# EAGLE design piezo-driver_v0.1-R001 (EAGLE 6.5.0)
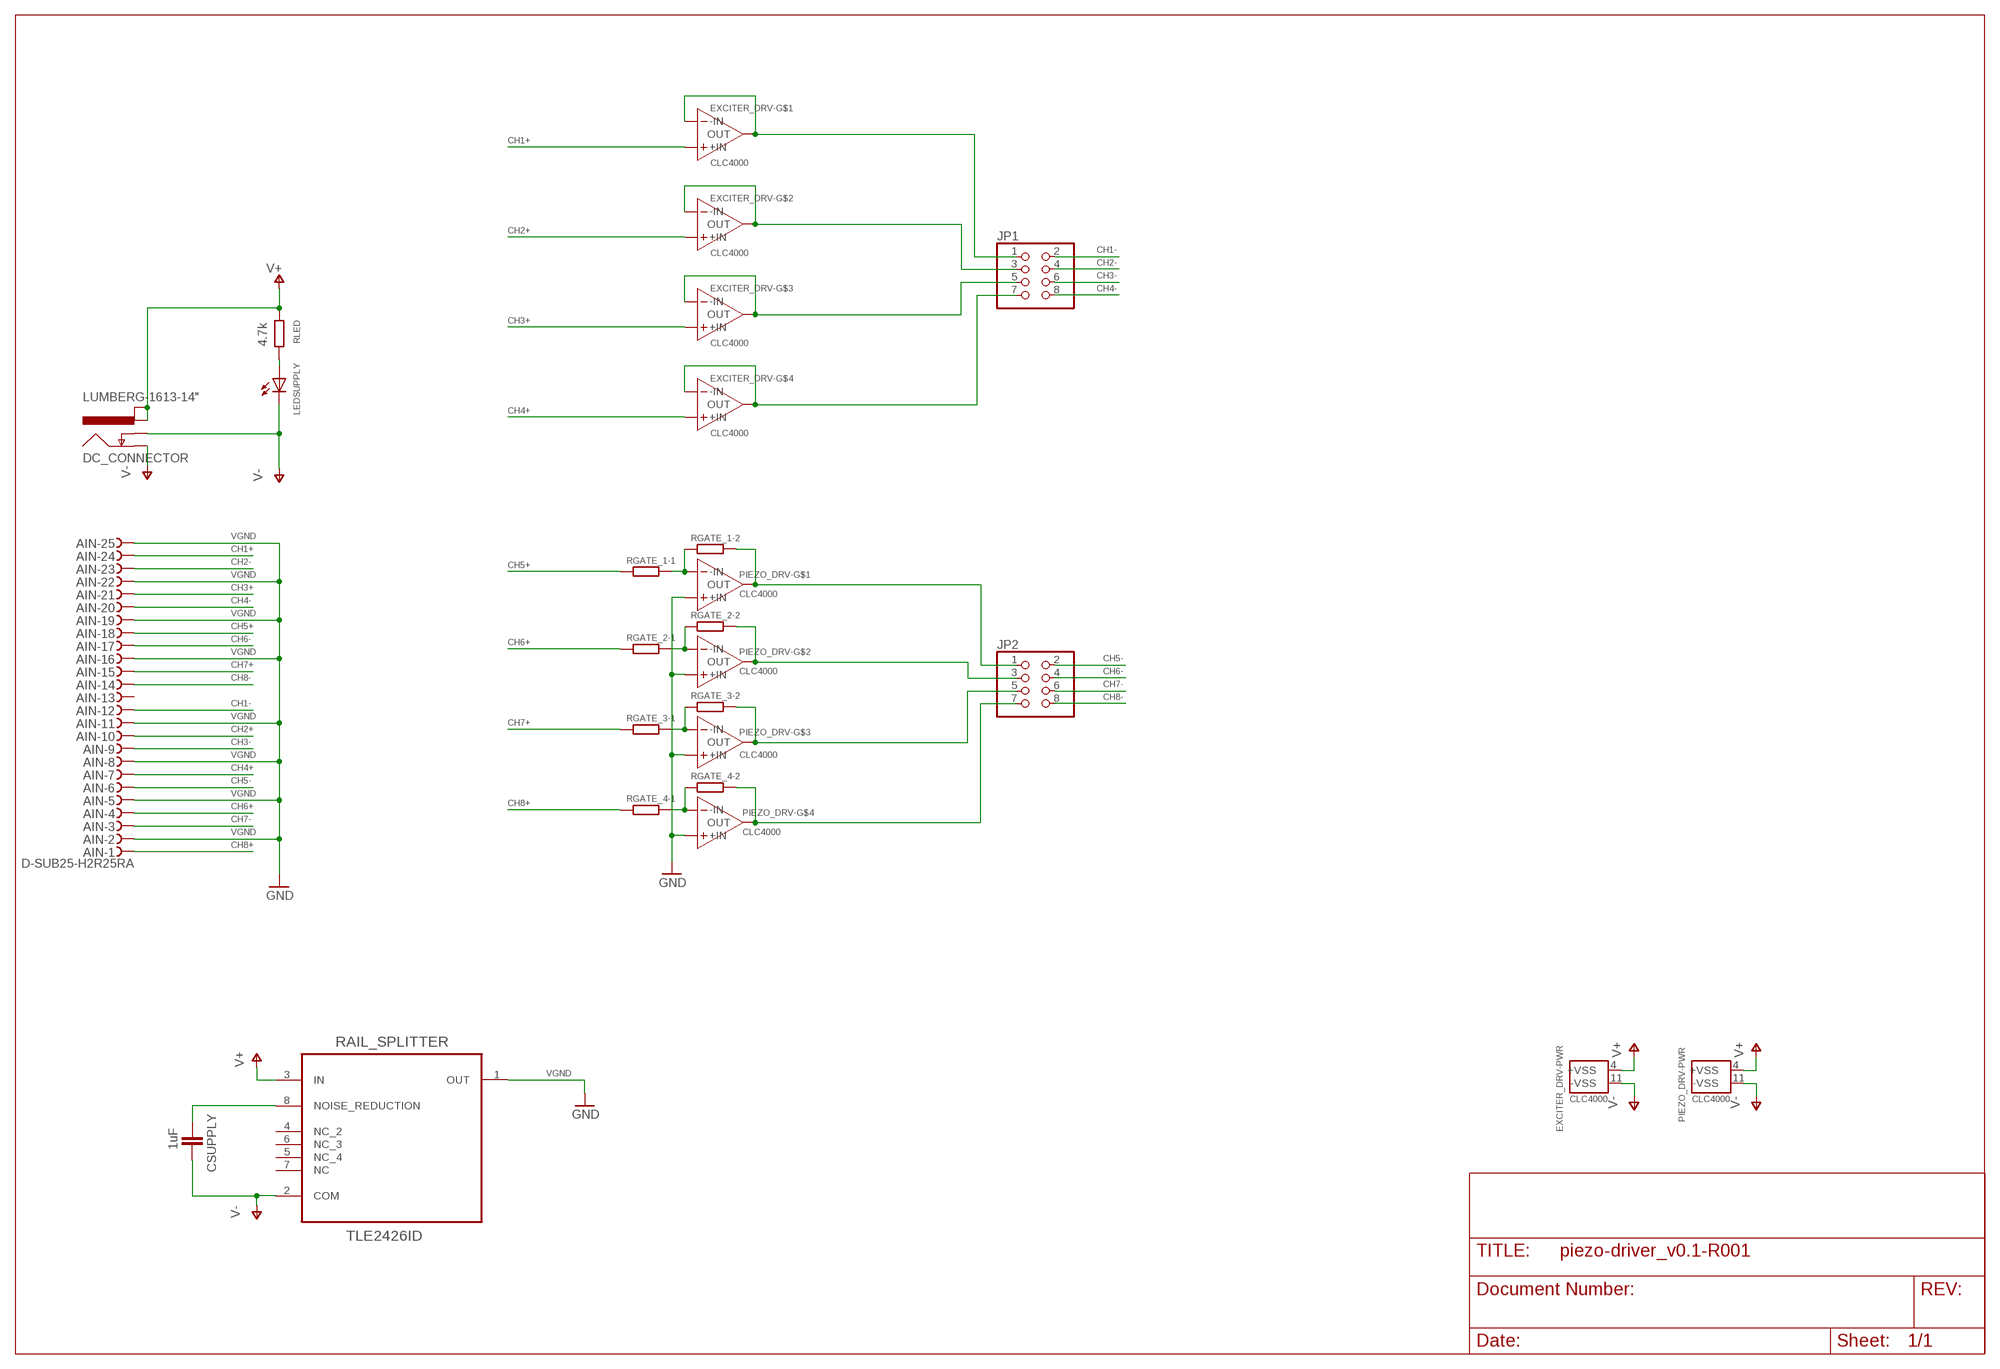
[diagram p0: schematic, sheet 1]

## Parts
AIN  D-SUB25-H2R25RA  [H2R25RA]
CSUPPLY  1uF  C-EUC0603  [C0603]
DC_CONNECTOR  LUMBERG-1613-14"  [LUMBERG-1613_14]
EXCITER_DRV  CLC4000  [SOIC-14]
JP1  PINHD-2X4/90  [2X04/90]
JP2  PINHD-2X4/90  [2X04/90]
LEDSUPPLY  LED3MM  [LED3MM]
PIEZO_DRV  CLC4000  [SOIC-14]
RAIL_SPLITTER  TLE2426ID  [SOIC127P600X175-8N]
RGATE_1-1  R-EU_R0805  [R0805]
RGATE_1-2  R-EU_R0805  [R0805]
RGATE_2-1  R-EU_R0805  [R0805]
RGATE_2-2  R-EU_R0805  [R0805]
RGATE_3-1  R-EU_R0805  [R0805]
RGATE_3-2  R-EU_R0805  [R0805]
RGATE_4-1  R-EU_R0805  [R0805]
RGATE_4-2  R-EU_R0805  [R0805]
RLED  4.7k  R-EU_R0805  [R0805]

## Nets
CH1+: AIN.24 EXCITER_DRV.3(-G$1:+IN)
CH1-: AIN.12 JP1.2
CH2+: AIN.10 EXCITER_DRV.5(-G$2:+IN)
CH2-: AIN.23 JP1.4
CH3+: AIN.21 EXCITER_DRV.10(-G$3:+IN)
CH3-: AIN.9 JP1.6
CH4+: AIN.7 EXCITER_DRV.12(-G$4:+IN)
CH4-: AIN.20 JP1.8
CH5+: AIN.18 RGATE_1-1.1
CH5-: AIN.6 JP2.2
CH6+: AIN.4 RGATE_2-1.1
CH6-: AIN.17 JP2.4
CH7+: AIN.15 RGATE_3-1.1
CH7-: AIN.3 JP2.6
CH8+: AIN.1 RGATE_4-1.1
CH8-: AIN.14 JP2.8
N$1: EXCITER_DRV.1(-G$1:OUT) EXCITER_DRV.2(-G$1:-IN) JP1.1
N$2: EXCITER_DRV.6(-G$2:-IN) EXCITER_DRV.7(-G$2:OUT) JP1.3
N$3: EXCITER_DRV.8(-G$3:OUT) EXCITER_DRV.9(-G$3:-IN) JP1.5
N$4: EXCITER_DRV.13(-G$4:-IN) EXCITER_DRV.14(-G$4:OUT) JP1.7
N$5: CSUPPLY.1 RAIL_SPLITTER.8(NOISE_REDUCTION)
N$6: PIEZO_DRV.2(-G$1:-IN) RGATE_1-1.2 RGATE_1-2.1
N$7: JP2.1 PIEZO_DRV.1(-G$1:OUT) RGATE_1-2.2
N$8: PIEZO_DRV.6(-G$2:-IN) RGATE_2-1.2 RGATE_2-2.1
N$9: JP2.3 PIEZO_DRV.7(-G$2:OUT) RGATE_2-2.2
N$10: PIEZO_DRV.9(-G$3:-IN) RGATE_3-1.2 RGATE_3-2.1
N$11: JP2.5 PIEZO_DRV.8(-G$3:OUT) RGATE_3-2.2
N$12: PIEZO_DRV.13(-G$4:-IN) RGATE_4-1.2 RGATE_4-2.1
N$13: JP2.7 PIEZO_DRV.14(-G$4:OUT) RGATE_4-2.2
N$15: LEDSUPPLY.A RLED.1
V+: DC_CONNECTOR.3(PWR_1) DC_CONNECTOR.4(PWR_2) EXCITER_DRV.4(-PWR:+VSS) PIEZO_DRV.4(-PWR:+VSS) RAIL_SPLITTER.3(IN) RLED.2
V-: CSUPPLY.2 DC_CONNECTOR.1(GND) DC_CONNECTOR.2(GND_INS) EXCITER_DRV.11(-PWR:-VSS) LEDSUPPLY.K(C) PIEZO_DRV.11(-PWR:-VSS) RAIL_SPLITTER.2(COM)
VGND: AIN.2 AIN.5 AIN.8 AIN.11 AIN.16 AIN.19 AIN.22 AIN.25 PIEZO_DRV.3(-G$1:+IN) PIEZO_DRV.5(-G$2:+IN) PIEZO_DRV.10(-G$3:+IN) PIEZO_DRV.12(-G$4:+IN) RAIL_SPLITTER.1(OUT) ; supply symbol labelled GND
Unconnected: AIN.13 RAIL_SPLITTER.4(NC_2) RAIL_SPLITTER.5(NC_4) RAIL_SPLITTER.6(NC_3) RAIL_SPLITTER.7(NC)

## Library data of the parts
AIN = ICST:D-SUB25-: D-Subminiatur Connector Source: Electronioc Interconnects European Edition 1998; OC_FARNELL: unknown; OC_NEWARK: unknown
CSUPPLY = rcl:C-EU: CAPACITOR, European symbol
DC_CONNECTOR = SABRe:LUMBERG-1613-14
EXCITER_DRV PIEZO_DRV = ICST:CLC4000
JP1 JP2 = ICST:PINHD-2X4: PIN HEADER
LEDSUPPLY = SABRe:LED: LEDs Standard schematic elements and footprints for packages: 5mm 3mm 1206 0603
RAIL_SPLITTER = Texas Instruments_By_element14_Batch_1:TLE2426ID: PRECISION VIRTUAL GROUND; MPN: TLE2426ID; OC_FARNELL: 8454833; OC_NEWARK: 35K1234; PACKAGE: SOIC-8; SUPPLIER: Texas Instruments
RGATE_1-1 RGATE_1-2 RGATE_2-1 RGATE_2-2 RGATE_3-1 RGATE_3-2 RGATE_4-1 RGATE_4-2 RLED = rcl:R-EU_: RESISTOR, European symbol

## Board
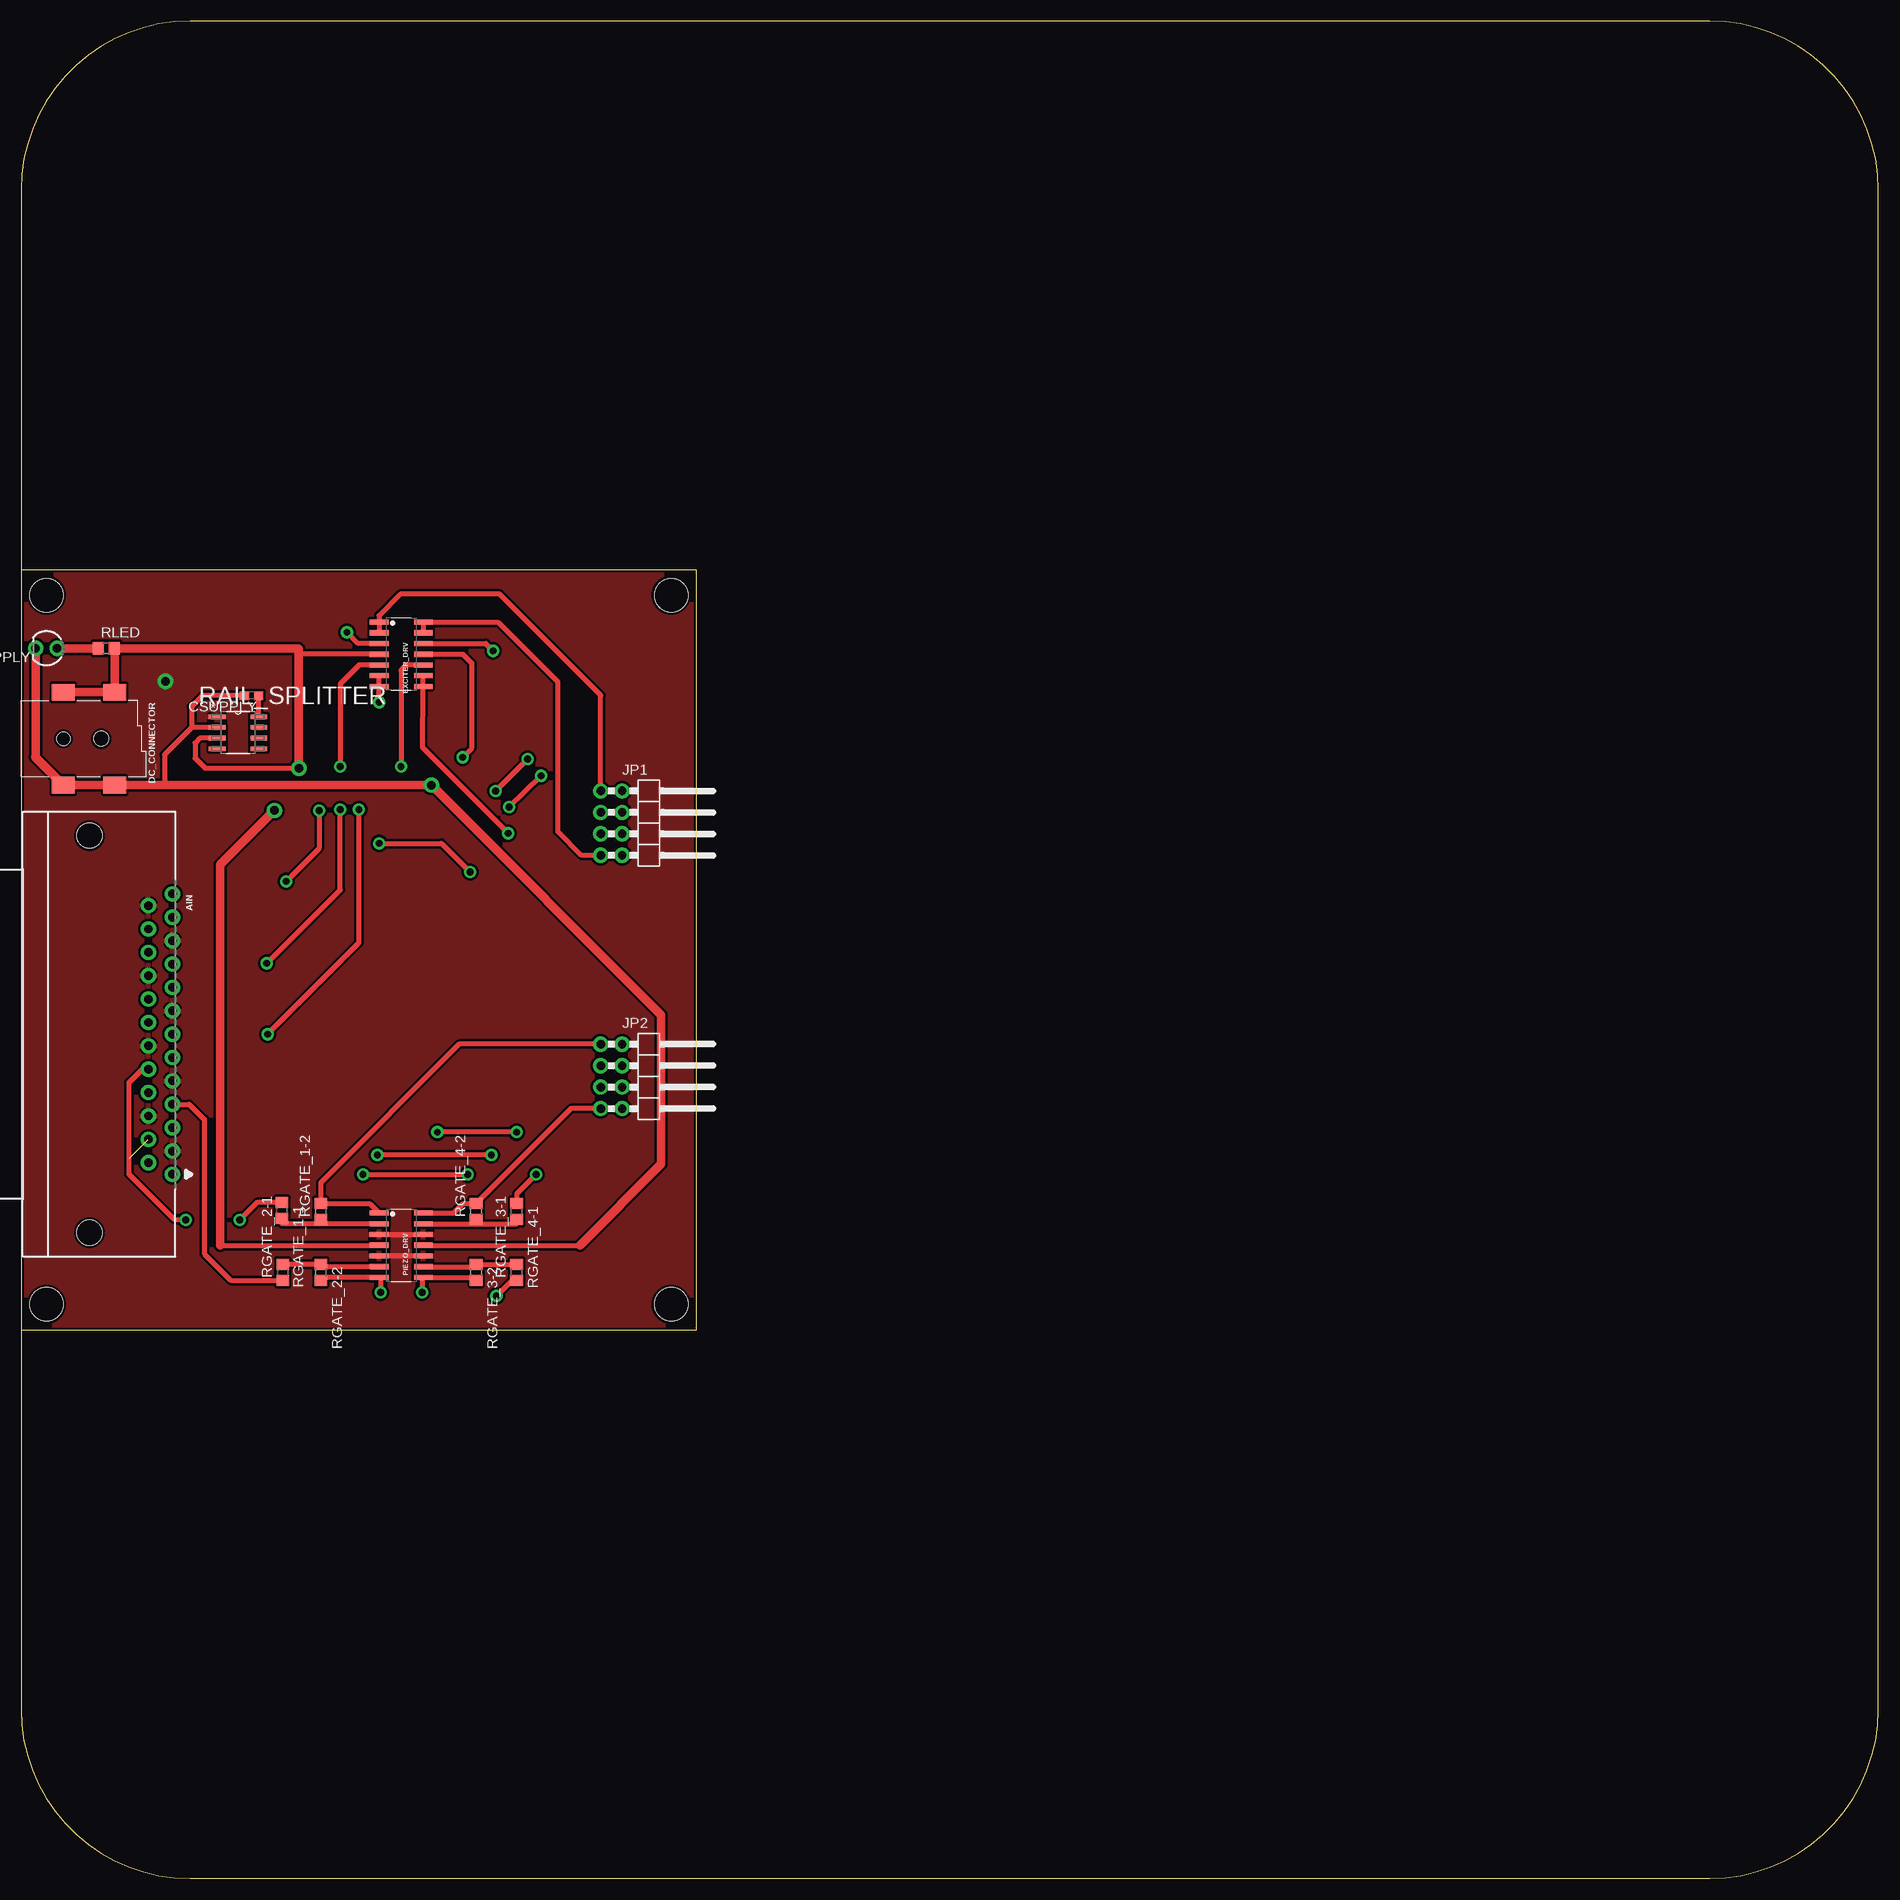
[diagram p1: board, top side]
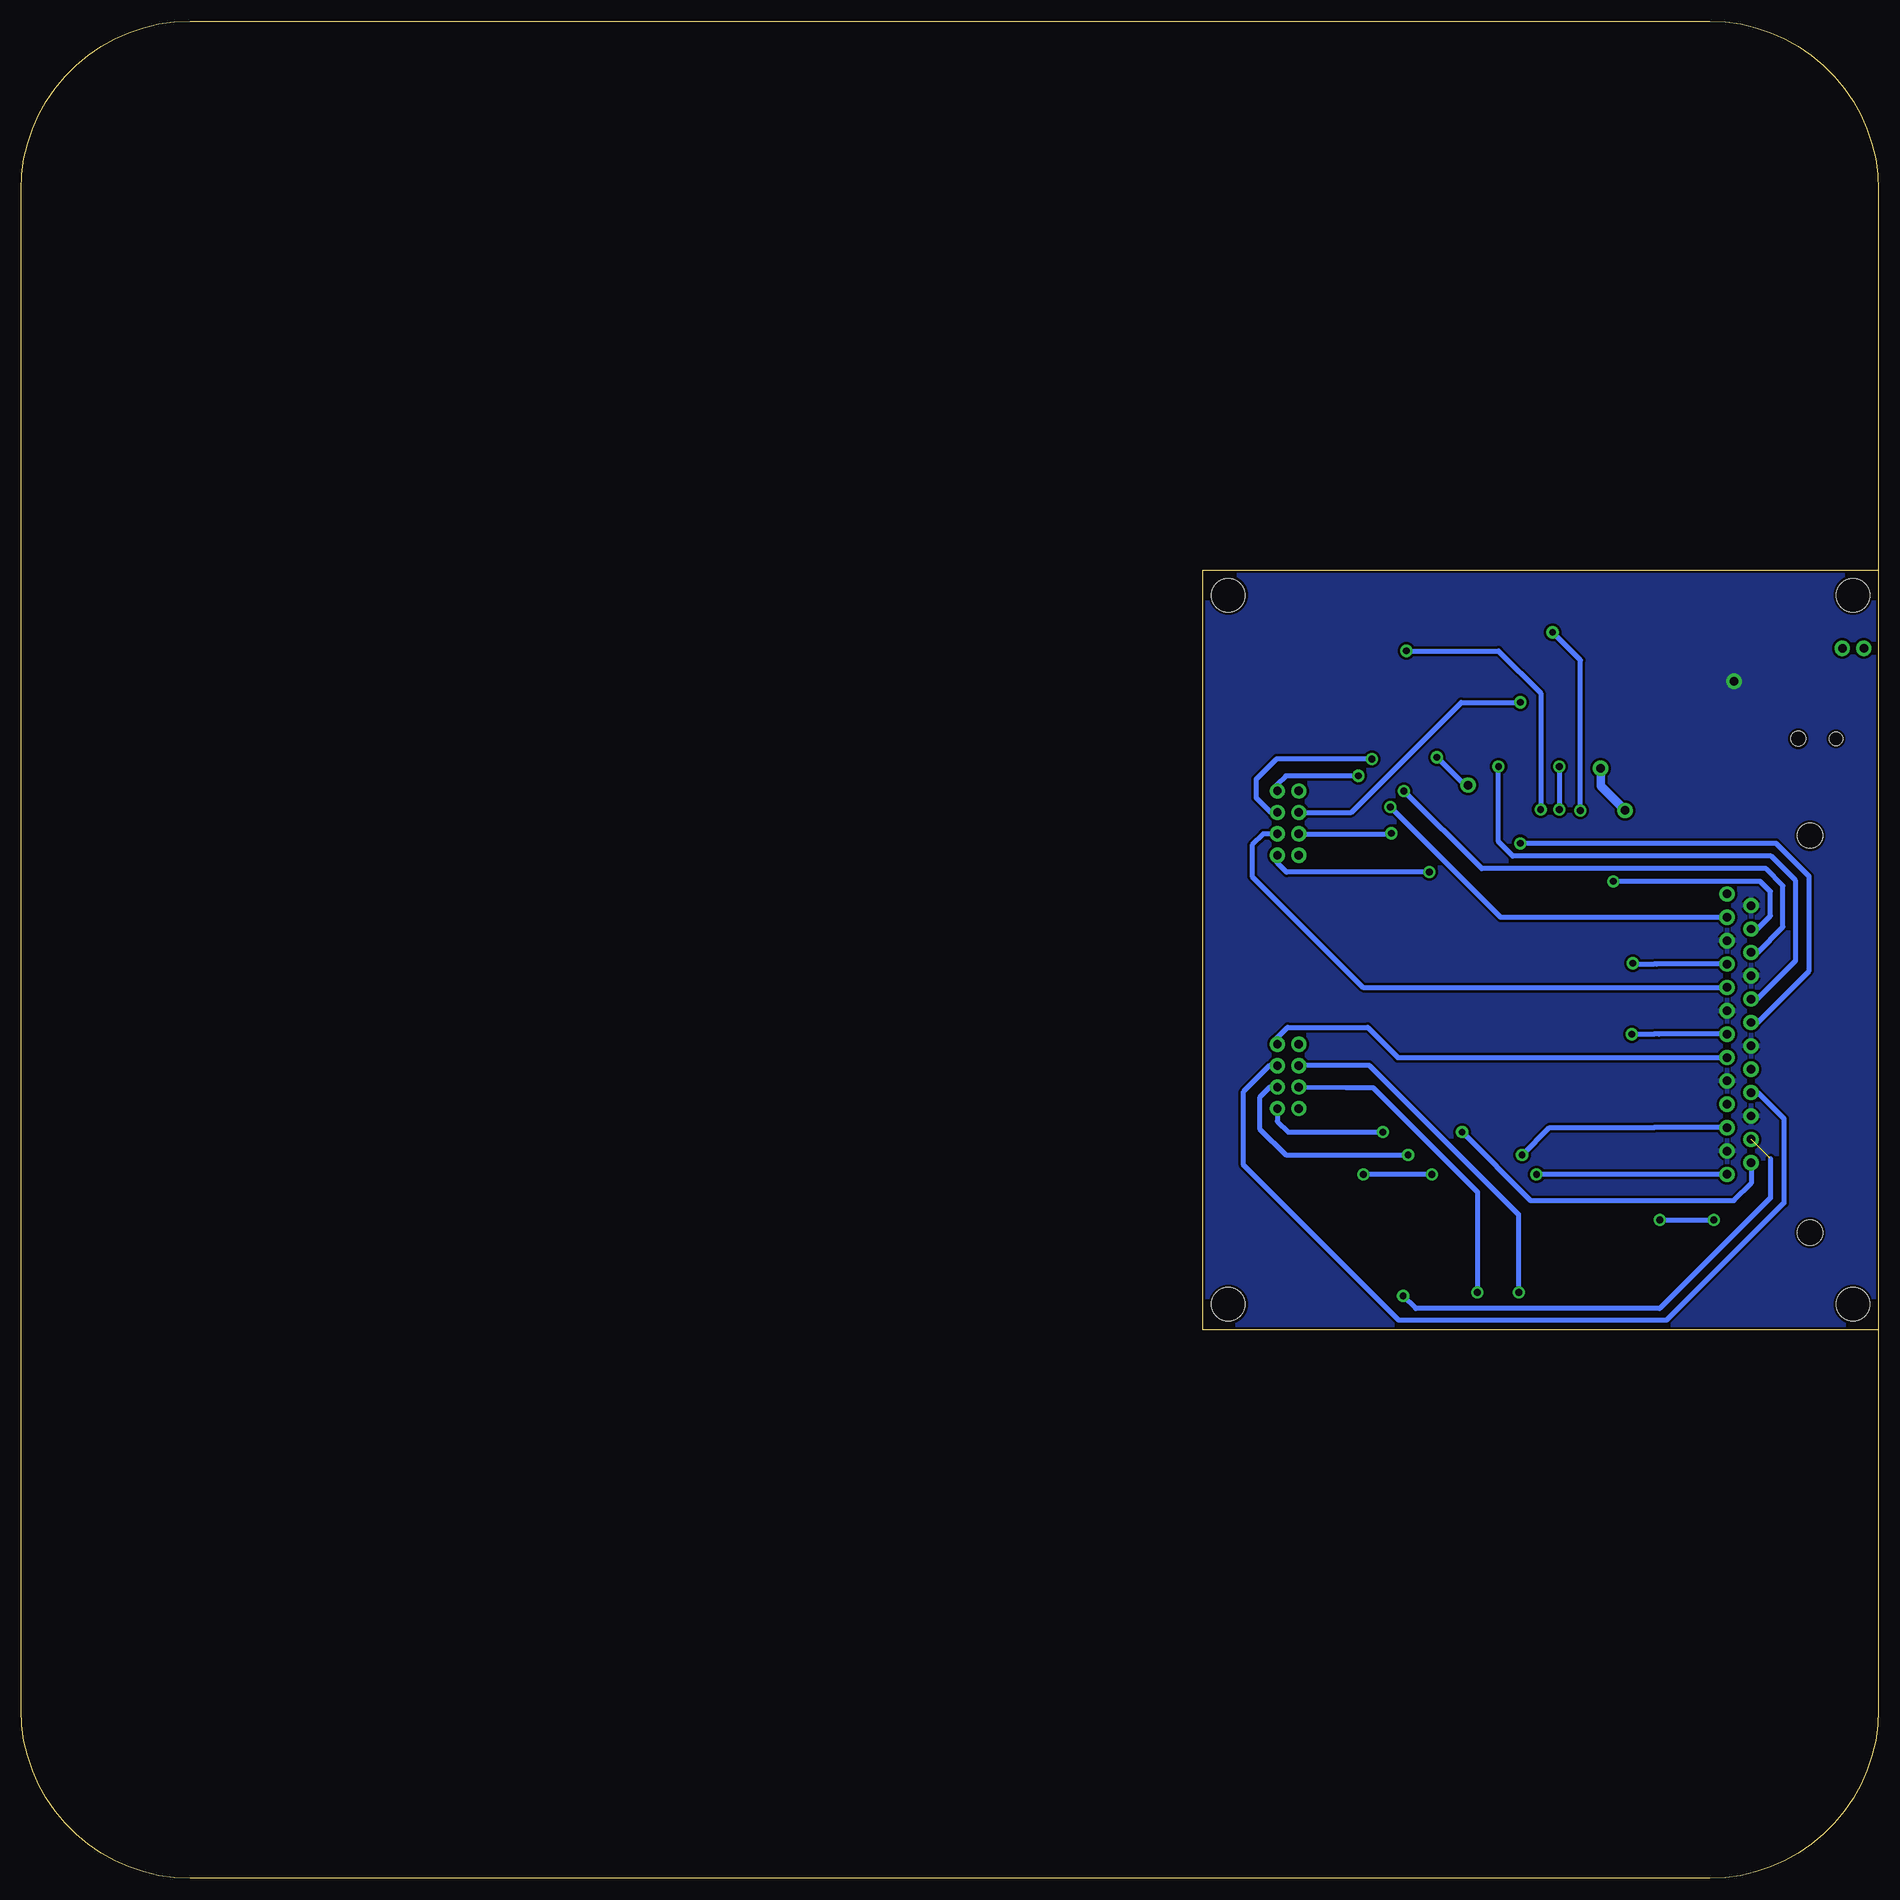
[diagram p2: board, bottom side, seen from below]

Size 220 x 220 mm. Coordinates in mm from the lower left corner, seen from the top.
Outline: 0,155 0,200 arc-90 20,220 200,220 arc-90 220,200 220,20 arc-90 200,0 20,0 arc-90 0,20 0,65
Outline: 0,155 0,65
Outline: 0,65 80,65 80,155 0,155
Copper layers (1*16): Top 0mil / dielectric 0.8mm / Bottom 0.035mm
Design rules "ICST_gravur": minimum track width 0.4mm, minimum drill 0.4mm, track to track 0.15mm, track to pad 0.15mm, pad to pad 0.15mm, via to via 0.15mm, smd to smd 0mil, copper to edge 0.2mm, drill to drill 0.2mm, minimum pad ring 0.1mm, minimum via ring 0.1mm, stop-mask expansion 0.15mm, vias tented up to drill 0.3mm, thermal gap 0.25mm
Holes 4 mm at 3,152 77,152 77,68 3,68

### Footprints (pad centres in the part's own frame; a part is rotated, then mirrored left to right if it is on the bottom)
H2R25RA = drill 1: 1 16.612,7.925; 2 13.843,7.925; 3 11.074,7.925; 4 8.306,7.925; 5 5.537,7.925; 6 2.769,7.925; 7 0,7.925; 8 -2.769,7.925; 9 -5.537,7.925; 10 -8.306,7.925; 11 -11.074,7.925; 12 -13.843,7.925; 13 -16.612,7.925; 14 15.227,5.08; 15 12.459,5.08; 16 9.69,5.08; 17 6.921,5.08; 18 4.153,5.08; 19 1.384,5.08; 20 -1.384,5.08; 21 -4.153,5.08; 22 -6.921,5.08; 23 -9.69,5.08; 24 -12.459,5.08; 25 -15.227,5.08 | hole 3: -23.52,-1.905; 23.52,-1.905
C0603 = smd 1.1 x 1: 1 -0.85,0; 2 0.85,0
LUMBERG-1613_14 = smd 2 x 2.7: 1 5.5,5; 2 5.5,11.1; 3 -5.5,11.1; 4 -5.5,5 | hole 1.6: 0,5 | hole 1.8: 0,9.5
SOIC-14 = smd 0.61 x 2.21: 1 -3.81,-2.591; 2 -2.54,-2.591; 3 -1.27,-2.591; 4 0,-2.591; 5 1.27,-2.591; 6 2.54,-2.591; 7 3.81,-2.591; 8 3.81,2.642; 9 2.54,2.642; 10 1.27,2.642; 11 0,2.642; 12 -1.27,2.642; 13 -2.54,2.642; 14 -3.81,2.642
2X04/90 = drill 1: 1 -3.81,-6.35; 2 -3.81,-3.81; 3 -1.27,-6.35; 4 -1.27,-3.81; 5 1.27,-6.35; 6 1.27,-3.81; 7 3.81,-6.35; 8 3.81,-3.81
LED3MM = drill 1: A -1.27,0; K 1.27,0
SOIC127P600X175-8N = smd 1.981 x 0.559: 1 -2.464,1.905; 2 -2.464,0.635; 3 -2.464,-0.635; 4 -2.464,-1.905; 5 2.464,-1.905; 6 2.464,-0.635; 7 2.464,0.635; 8 2.464,1.905
R0805 = smd 1.3 x 1.5: 1 -0.95,0; 2 0.95,0

### Placement (x,y rotation side)
AIN  10,100 270 top
CSUPPLY  27.3,140.1 180 top
DC_CONNECTOR  0,135 270 top
EXCITER_DRV  45,145 270 top
JP1  75,125 270 top
JP2  75,95 270 top
LEDSUPPLY  3,145.7 180 top
PIEZO_DRV  45,75 270 top
RAIL_SPLITTER  25.7,135.7 0 top
RGATE_1-1  30.9,79.1 270 top
RGATE_1-2  35.5,79 90 top
RGATE_2-1  31,71.8 90 top
RGATE_2-2  35.5,71.8 270 top
RGATE_3-1  58.7,71.8 90 top
RGATE_3-2  53.9,71.8 270 top
RGATE_4-1  58.7,79 270 top
RGATE_4-2  53.9,79 90 top
RLED  10.1,145.7 0 top

### Tracks (layer width: path | path; a pad name or v marks a point on that pad's centre or on a via)
CH1+  (via drill 0.8)
  Top 0.6: EXCITER_DRV.3 39.93,146.27 v38.6,147.6 | v35.3,126.5 35.3,122 v31.4,118.1
  Bottom 0.6: v35.3,126.5 35.3,144.3 v38.6,147.6 | v31.4,118.1 14,118.1 12.8,116.9 12.8,114 14.34,112.46 AIN.24
CH1-  (via drill 0.8)
  Top 0.6: v61.6,130.6 v57.8,126.9
  Bottom 0.6: AIN.12 44.74,113.84 v57.8,126.9 | v61.6,130.6 70.2,130.6 71.19,129.61 JP1.2
CH2+  (via drill 0.8)
  Top 0.6: EXCITER_DRV.5 40.03,143.73 37.8,141.5 v37.8,131.7 | v37.8,126.6 37.8,117.1 v29.1,108.4
  Bottom 0.6: v37.8,131.7 v37.8,126.6 | AIN.10 26.3,108.31 26.61,108.31 29.01,108.31 v29.1,108.4
CH2-  (via drill 0.8)
  Top 0.6: v60,132.6 v56.2,128.8
  Bottom 0.6: v60,132.6 71.3,132.6 73.7,130.2 73.7,128 71.97,126.27 JP1.4 | v56.2,128.8 47,119.6 13.3,119.6 11.3,117.6 11.3,112.7 14.31,109.69 AIN.23
CH3+  (via drill 0.8)
  Top 0.6: EXCITER_DRV.10 45.63,143.73 45,143.1 v45,131.7
  Bottom 0.6: v45,131.7 45,122.8 43.3,121.1 12.7,121.1 9.8,118.2 9.8,108.7 14.35,104.15 AIN.21
CH3-
  Bottom 0.6: JP1.6 72.87,123.73 74.2,122.4 74.2,118.7 61.04,105.54 AIN.9
CH4+  (via drill 0.8)
  Top 0.6: EXCITER_DRV.12 55.03,146.27 v55.9,145.4 | v40,126.6 40,110.8 v29.2,100
  Bottom 0.6: v55.9,145.4 45,145.4 40,140.4 v40,126.6 | AIN.7 26,100 26.6,100 v29.2,100
CH4-  (via drill 0.8)
  Top 0.6: v42.4,122.6 49.8,122.6 v53.2,119.2
  Bottom 0.6: v42.4,122.6 12.1,122.6 8.2,118.7 8.2,107.5 14.32,101.38 AIN.20 | v53.2,119.2 70.1,119.2 71.19,120.29 JP1.8
CH5+  (via drill 0.8)
  Top 0.6: RGATE_1-1.1 27.95,80.05 v25.9,78 | v19.5,78 18.2,78 12.8,83.4 12.8,94.3 14.35,95.85 AIN.18
  Bottom 0.6: v25.9,78 v19.5,78
CH5-
  Bottom 0.6: AIN.6 56.93,97.23 60.5,100.8 70,100.8 71.19,99.61 JP2.2
CH6+
  Top 0.6: 31,70.9 RGATE_2-1.1 24.85,70.85 21.7,74 21.7,89.9 19.91,91.69 AIN.4
CH6-
  Bottom 0.6: JP2.4 72.13,96.27 75.2,93.2 75.2,84.5 56.8,66.1 25.1,66.1 11.2,80 11.2,90 14.28,93.08 AIN.17
CH7+  (via drill 0.8)  (1 unrouted)
  Top 0.6: v56.3,69 58.15,70.85 RGATE_3-1.1
  Bottom 0.6: 12.8,85.26 12.8,80.6 25.9,67.5 54.8,67.5 v56.3,69
CH7-  (via drill 0.8)
  Top 0.6: v55.7,85.7 v42.2,85.7
  Bottom 0.6: AIN.3 26.57,88.93 | 26.57,88.93 26.6,88.9 | v42.2,85.7 38.97,88.93 26.57,88.93 | v55.7,85.7 70.2,85.7 73.3,88.8 73.3,92.5 72.07,93.73 JP2.6
CH8+  (via drill 0.8)
  Top 0.6: v40.5,83.4 v52.9,83.4 | v61,83.4 58.7,81.1 RGATE_4-1.1
  Bottom 0.6: AIN.1 26.29,83.39 26.3,83.4 v40.5,83.4 | v52.9,83.4 v61,83.4
CH8-  (via drill 0.8)
  Top 0.6: v58.7,88.4 v49.3,88.4
  Bottom 0.6: AIN.14 15.08,82.32 17.1,80.3 41.2,80.3 v49.3,88.4 | JP2.8 71.19,89.69 69.9,88.4 v58.7,88.4
N$1
  Top 0.6: EXCITER_DRV.2 EXCITER_DRV.1 42.41,149.61 44.9,152.1 56.7,152.1 68.65,140.15 JP1.1
N$2  (via drill 0.8)
  Top 0.6: EXCITER_DRV.6 EXCITER_DRV.7 v42.4,139.3
  Bottom 0.6: JP1.3 62.43,126.27 49.4,139.3 v42.4,139.3
N$3  (via drill 0.8)
  Top 0.6: EXCITER_DRV.9 EXCITER_DRV.8 47.54,133.96 v57.7,123.8
  Bottom 0.6: JP1.5 57.77,123.73 v57.7,123.8
N$4
  Top 0.6: EXCITER_DRV.13 EXCITER_DRV.14 47.65,148.8 56.5,148.8 63.6,141.7 63.6,124 66.41,121.19 JP1.7
N$5
  Top 0.6: RAIL_SPLITTER.8 28.15,137.62 CSUPPLY.1
N$6
  Top 0.6: PIEZO_DRV.2 35.4,77.54 | 35.4,77.54 30.9,77.54 RGATE_1-1.2 | RGATE_1-2.1 35.4,78.05 35.4,77.54
N$7
  Top 0.6: JP2.1 51.91,98.81 35.5,82.4 RGATE_1-2.2 41.27,79.95 PIEZO_DRV.1
N$8
  Top 0.6: 30.95,72.75 RGATE_2-2.1 35.5,72.46 PIEZO_DRV.6
  Top 0.8: 30.95,72.75 RGATE_2-1.2
N$9  (via drill 0.8)
  Top 0.6: RGATE_2-2.2 35.5,71.19 PIEZO_DRV.7 42.6,71.19 v42.6,69.4
  Bottom 0.6: v42.6,69.4 42.6,78.6 60.3,96.3 68.62,96.3 JP2.3
N$10
  Top 0.6: PIEZO_DRV.9 53.9,72.46 RGATE_3-2.1 RGATE_3-1.2
N$11  (via drill 0.8)
  Top 0.6: PIEZO_DRV.8 53.9,71.19 RGATE_3-2.2 | 47.5,71.19 PIEZO_DRV.8 | PIEZO_DRV.8 47.5,71.05 v47.5,69.4
  Bottom 0.6: JP2.5 63.07,93.67 59.87,93.67 47.5,81.3 v47.5,69.4
N$12
  Top 0.6: PIEZO_DRV.13 54,77.54 | 54,77.54 58.7,77.54 RGATE_4-1.2 | RGATE_4-2.1 54,78.05 54,77.54
N$13
  Top 0.6: JP2.7 65.14,91.19 RGATE_4-2.2 52.35,79.95 51.21,78.81 PIEZO_DRV.14
N$15
  Top 1: LEDSUPPLY.A RLED.1
V+  (via drill 1)
  Top 0.6: EXCITER_DRV.4 32.9,145 | 23.6,75 PIEZO_DRV.4 | v32.9,131.5 21.8,131.5 20.6,132.7 20.6,134.5 21.16,135.06 RAIL_SPLITTER.3
  Top 1: DC_CONNECTOR.4 DC_CONNECTOR.3 | 11.05,140.5 DC_CONNECTOR.3 | v32.9,131.5 32.9,145 32.9,145.7 RLED.2 11.1,145.7 DC_CONNECTOR.3 | v30,126.5 23.6,120.1 23.6,75
  Bottom 1: v32.9,131.5 32.9,129.4 v30,126.5
V-  (via drill 0.8, 1)
  Top 0.6: PIEZO_DRV.11 66.2,75 | 16.9,129.5 17,129.6 17,133.1 20.23,136.34 | EXCITER_DRV.11 52.3,145 53.4,143.9 53.4,133.9 v52.3,132.8 | CSUPPLY.2 21.5,140.1 20.2,138.8 20.2,136.37 20.23,136.34 | RAIL_SPLITTER.2 20.23,136.34
  Top 1: 1.73,132.77 DC_CONNECTOR.1 DC_CONNECTOR.2 16.9,129.5 v48.6,129.5 75.8,102.3 75.8,84.6 66.2,75 | 1.73,132.77 1.7,132.8 | LEDSUPPLY.K 1.73,132.77
  Bottom 0.6: v52.3,132.8 49,129.5 v48.6,129.5
VGND  (via drill 1)
  Top 0.6: PIEZO_DRV.3 PIEZO_DRV.12 | PIEZO_DRV.10 PIEZO_DRV.5
  other vias: 17.1,141.8
  pour Top (isolate 0.3): 0,65 0,155 80,155 80,65
  pour Bottom (isolate 0.3): 0,65 0,155 80,155 80,65